# Altium schematic sheet Supplies.SchDoc
size A; DocumentNumber: 6; SheetNumber: 6
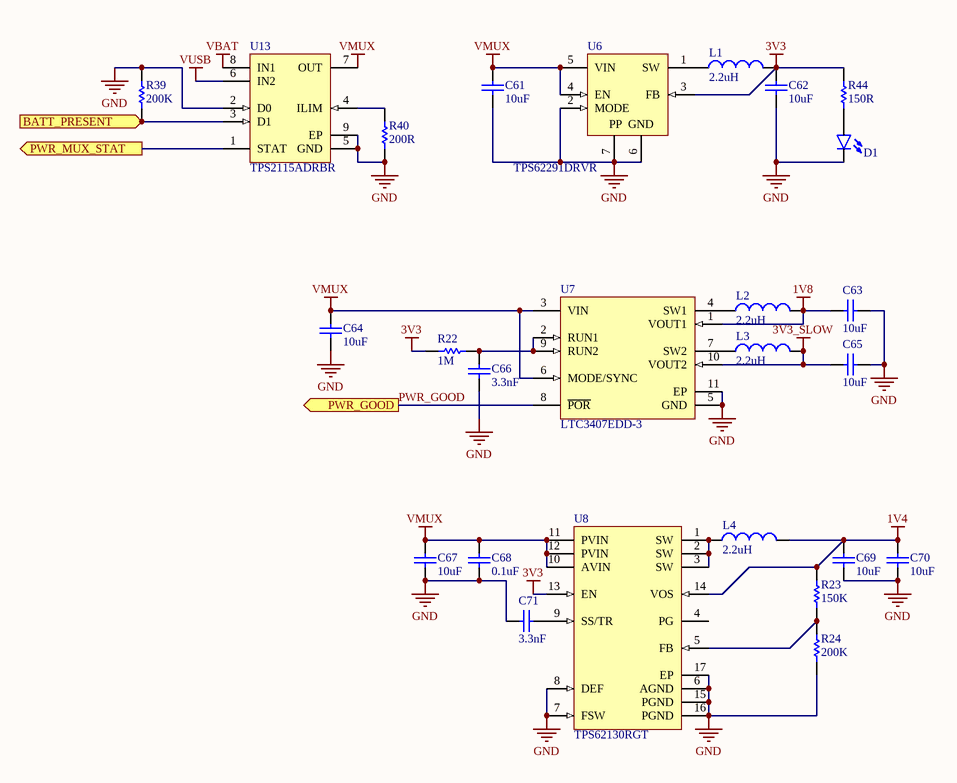
[diagram p0: Supplies.SchDoc]

## Parts
C61  value 10uF  [C0402[1005X55]]  (hidden comment: 10uF 6.3V 0402)
C62  value 10uF  [C0402[1005X55]]  (hidden comment: 10uF 6.3V 0402)
C63  value 10uF  [C0402[1005X55]]  (hidden comment: 10uF 6.3V 0402)
C64  value 10uF  [C0402[1005X55]]  (hidden comment: 10uF 6.3V 0402)
C65  value 10uF  [C0402[1005X55]]  (hidden comment: 10uF 6.3V 0402)
C66  value 3.3nF  [C0402[1005X55]]  (hidden comment: 3.3nF 50V 0402)
C67  value 10uF  [C0402[1005X55]]  (hidden comment: 10uF 6.3V 0402)
C68  value 0.1uF  [C0402[1005X55]]  (hidden comment: 0.1uF 6.3V 0402)
C69  value 10uF  [C0402[1005X55]]  (hidden comment: 10uF 6.3V 0402)
C70  value 10uF  [C0402[1005X55]]  (hidden comment: 10uF 6.3V 0402)
C71  value 3.3nF  [C0402[1005X55]]  (hidden comment: 3.3nF 50V 0402)
D1  LED_0603_BLUE_5mA  [LED0603]  (value not drawn)
L1  2.2uH  [IND0805]
L2  2.2uH  [IND0603]
L3  2.2uH  [IND0603]
L4  2.2uH  [IND1008]
R22  value 1M  [R0402[1005]]  (hidden comment: 1M 1% 0402)
R23  value 150K  [R0402[1005]]  (hidden comment: 150K 1% 0402)
R24  value 200K  [R0402[1005]]  (hidden comment: 200K 1% 0402)
R39  value 200K  [R0402[1005]]  (hidden comment: 200K 1% 0402)
R40  value 200R  [R0402[1005]]  (hidden comment: 200R 1% 0402)
R44  value 150R  [R0402[1005]]  (hidden comment: 150R 1% 0402)
U6  TPS62291DRVR  [WSON-6]
U7  LTC3407EDD-3  [VSON-10 (3mmx3mm)]
U8  TPS62130RGT  [QFN-16]
U13  TPS2115ADRBR  [VSON-8 (3x3MM)]

## Ports
BATT_PRESENT (in), PWR_GOOD (out), PWR_MUX_STAT (out)

## Nets
1V4: C69.2 C70.2 L4.2 R23.2 U8.14(VOS)
1V8: C63.2 L2.2 U7.1(VOUT1)
3V3: C62.2 L1.2 R22.2 R44.2 U6.3(FB) U8.13(EN)
3V3_SLOW: C65.1 L3.2 U7.10(VOUT2)
GND: C61.1 C62.1 C63.1 C64.1 C65.2 C66.1 C67.1 C68.1 C69.1 C70.1 C71.1 D1.C R24.1 R39.2 R40.1 U6.2(MODE) U6.6(GND) U6.7(EP) U7.5(GND) U7.11(EP) U8.6(AGND) U8.7(FSW) U8.8(DEF) U8.15(PGND) U8.16(PGND) U8.17(EP) U13.2(D0) U13.5(GND) U13.9(EP)
VBAT: U13.8(IN1)
VMUX: C61.2 C64.2 C67.2 C68.2 U6.4(EN) U6.5(VIN) U7.3(VIN) U7.6(MODE/SYNC) U8.10(AVIN) U8.11(PVIN) U8.12(PVIN) U13.7(OUT)
VUSB: U13.6(IN2)
BATT_PRESENT: R39.1 U13.3(D1) ; port BATT_PRESENT
PWR_GOOD: U7.8(~{POR}) ; port PWR_GOOD
PWR_MUX_STAT: U13.1(STAT) ; port PWR_MUX_STAT
NetC66_2: C66.2 R22.1 U7.2(RUN1) U7.9(RUN2)
NetC71_2: C71.2 U8.9(SS/TR)
NetD1_A: D1.A R44.1
NetL1_1: L1.1 U6.1(SW)
NetL2_1: L2.1 U7.4(SW1)
NetL3_1: L3.1 U7.7(SW2)
NetL4_1: L4.1 U8.1(SW) U8.2(SW) U8.3(SW)
NetR23_1: R23.1 R24.2 U8.5(FB)
NetR40_2: R40.2 U13.4(ILIM)

Not connected (* = marked no-connect by the designer): U8 4(PG)

## Notes on the sheet
- (in symbol TPS62291DRVR) PP

## Library data of the parts
C61-C65 C67 C69 C70 = CAP_10uF_6.3V_0402_20%: 10uF 6.3V 20% 0402 (1005 Metric); PartNumber: GRM155R60J106ME44D; Manufacturer: Murata; Tolerance: 20%; Mounting Technology: Surface Mount; PackageReference: 0402; PackageDescription: 0402 (1005 Metric); Voltage: 6.3V
C66 C71 = CAP_3.3nF_50V_0402_10%: 3.3nF 50V 10% 0402 (1005 Metric); PartNumber: GRM155R71H332KA01D; Manufacturer: Murata; Mounting Technology: Surface Mount; PackageReference: 0402; PackageDescription: 0402 (1005 Metric); Voltage: 50V; Tolerance: 10%
C68 = CAP_0.1uF_6.3V_0402_10%: 0.1uF 6.3V 10% 0402 (1005 Metric); PartNumber: GRM155R70J104KA01D; Manufacturer: Murata; Mounting Technology: Surface Mount; PackageReference: 0402; PackageDescription: 0402 (1005 Metric); Voltage: 6.3V; Tolerance: 10%
D1 = LED_0603_BLUE_5mA: PartNumber: LTST-C193TBKT-5A; Manufacturer: Lite-On Inc.; PackageReference: 0603; PackageDescription: 0603 (1608 Metric); Mounting Technology: Surface Mount
L1 = IND_2.2uH_1.7A_0805_20%: 2.2uH 20% 1.7A 0805; PartNumber: LQM21PN2R2MGHL; Manufacturer: Murata; PackageReference: 0805; PackageDescription: 0805 (2012 metric); Value: 2.2uH; Mounting Technology: Surface Mount; Current: 1.7A
L2 L3 = IND_2.2uH_750mA_0603_20%: 2.2uH 20% 750mA 0603; PartNumber: LQM18PZ2R2MCHD; Manufacturer: Murata; PackageReference: 0603; PackageDescription: 0603 (1608 metric); Value: 2.2uH; Mounting Technology: Surface Mount; Current: 750mA
L4 = IND_2.2uH_3.3A_1008_20%: 2.2uH 20% 3.3A 1008; PartNumber: DFE252012F-2R2M=P2; Manufacturer: Murata; PackageReference: 1008; PackageDescription: 1008 (2520 metric); Mounting Technology: Surface Mount; Current: 3.3A; Value: 2.2uH
R22 = RES_1M_0402_1%: 1M 0.063W 1% 0402 (1005 Metric); Manufacturer: KOA Speer; PartNumber: RK73H1ETTP1004F; Tolerance: 1%; Power: 0.063W; Mounting Technology: Surface Mount; PackageReference: 0402; PackageDescription: 0402 (1005 Metric); ComponentLink1Description: Datasheet; ComponentLink1URL: http://www.koaspeer.com/catimages/Products/RK73H/RK73H.pdf
R23 = RES_150K_0402_1%: 150K 0.063W 1% 0402 (1005 Metric); Manufacturer: KOA Speer; PartNumber: RK73H1ETTP1503F; Tolerance: 1%; Power: 0.063W; Mounting Technology: Surface Mount; PackageReference: 0402; PackageDescription: 0402 (1005 Metric); ComponentLink1Description: Datasheet; ComponentLink1URL: http://www.koaspeer.com/catimages/Products/RK73H/RK73H.pdf
R24 R39 = RES_200K_0402_1%: 200K 0.063W 1% 0402 (1005 Metric); Manufacturer: KOA Speer; PartNumber: RK73H1ETTP2003F; Tolerance: 1%; Power: 0.063W; Mounting Technology: Surface Mount; PackageReference: 0402; PackageDescription: 0402 (1005 Metric); ComponentLink1Description: Datasheet; ComponentLink1URL: http://www.koaspeer.com/catimages/Products/RK73H/RK73H.pdf
R40 = RES_200R_0402_1%: 200R 0.063W 1% 0402 (1005 Metric); Manufacturer: KOA Speer; PartNumber: RK73H1ETTP2000F; Tolerance: 1%; Power: 0.063W; Mounting Technology: Surface Mount; PackageReference: 0402; PackageDescription: 0402 (1005 Metric); ComponentLink1Description: Datasheet; ComponentLink1URL: http://www.koaspeer.com/catimages/Products/RK73H/RK73H.pdf
R44 = RES_150R_0402_1%: 150R 0.063W 1% 0402 (1005 Metric); Manufacturer: KOA Speer; PartNumber: RK73H1ETTP1500F; Tolerance: 1%; Power: 0.063W; Mounting Technology: Surface Mount; PackageReference: 0402; PackageDescription: 0402 (1005 Metric); ComponentLink1Description: Datasheet; ComponentLink1URL: http://www.koaspeer.com/catimages/Products/RK73H/RK73H.pdf
U6 = TPS62291DRVR: Voltage Regulators - Switching Regulators 2.25MHz 1A Step-Down Cnvrtr 3.3V Output; Manufacturer: Texas Instruments; PartNumber: TPS62291DRVR; PackageReference: WSON-6; PackageDescription: SON, 6-Leads, Body 2x2mm, Pitch 0.65mm, Thermal Pad 1.6x1mm, TI Recommended; Mounting Technology: Surface Mount
U7 = LTC3407EDD-3: Manufacturer: Linear Technology; PartNumber: LTC3407EDD-3; PackageReference: SON-10; Mounting Technology: Surface Mount
U8 = TPS62130RGT: Manufacturer: Texas Instruments; PartNumber: TPS62130RGT; PackageReference: QFN-16; Mounting Technology: Surface Mount
U13 = TPS2115ADRBR: Power Switch ICs - Power Distribution Autoswitching Pwr Mux; Manufacturer: Texas Instruments; PartNumber: TPS2115ADRBR; PackageReference: VSON-8; Mounting Technology: Surface Mount